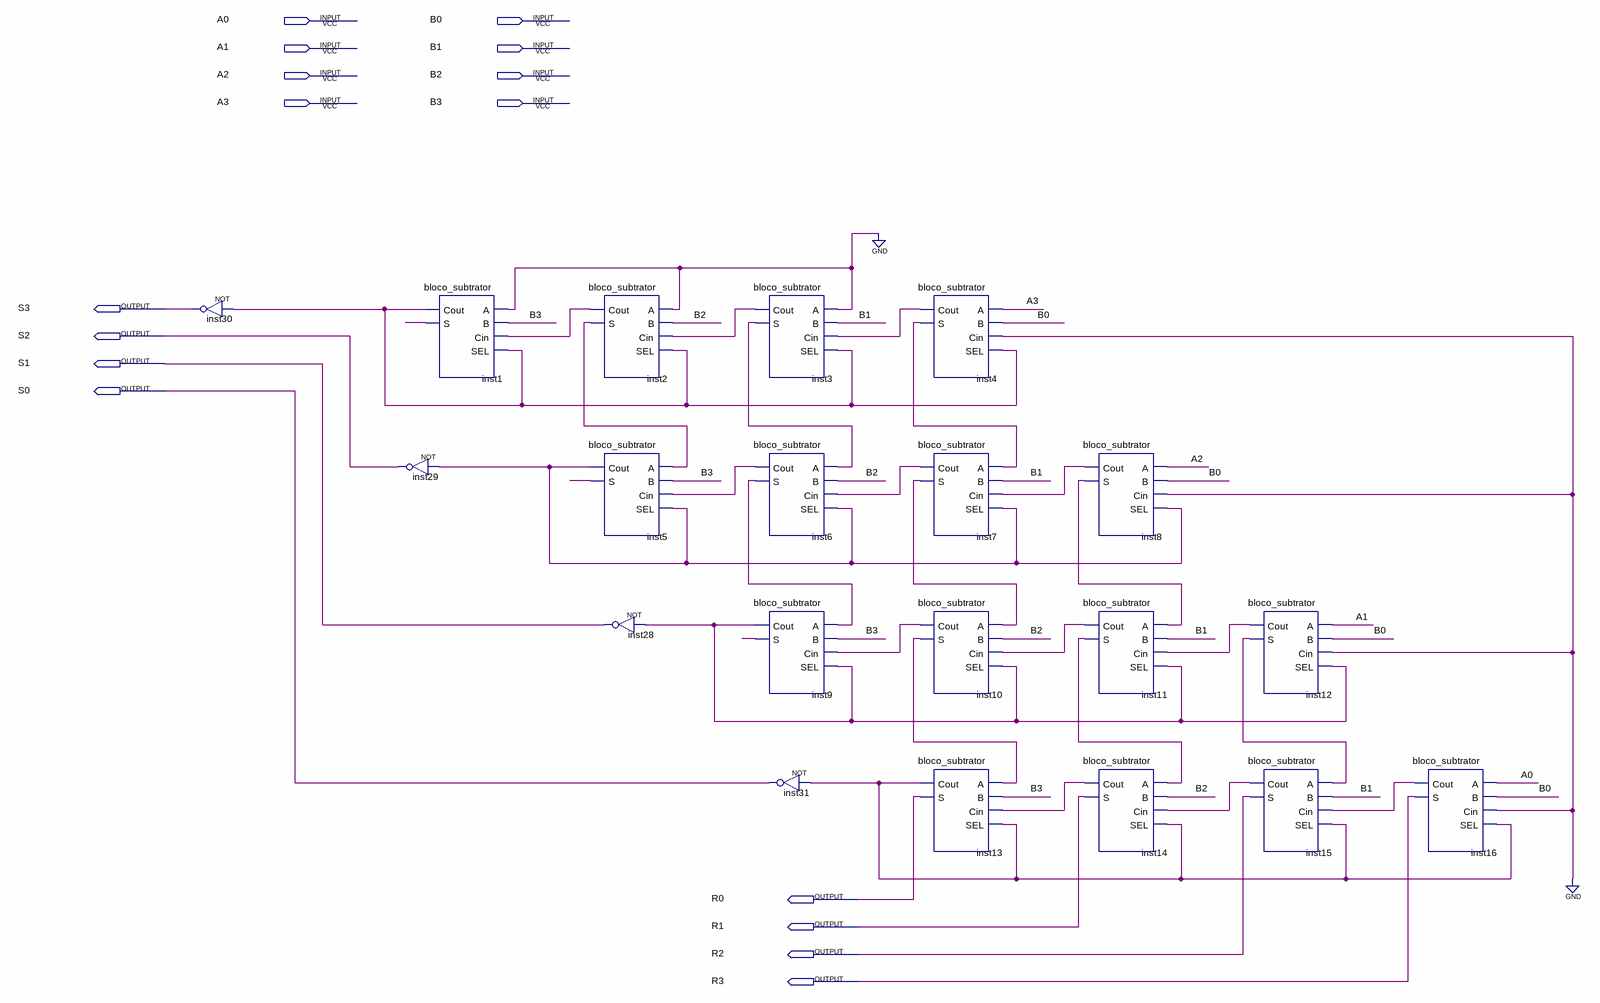
[diagram p0: schematic sheet]
// Quartus schematic divisor.bdf as structural Verilog: 20 symbols, 16 pins
module divisor (
  input  A0,
  input  B0,
  input  A1,
  input  B1,
  input  A2,
  input  B2,
  input  A3,
  input  B3,
  output S3,
  output S2,
  output S1,
  output S0,
  output R0,
  output R1,
  output R2,
  output R3
);

  wire inst1_cout, inst1_s, inst2_cout, inst2_s, inst3_cout, inst3_s, inst4_cout, inst4_s, inst5_cout,
       inst5_s, inst6_cout, inst6_s, inst7_cout, inst7_s, inst8_cout, inst8_s, inst9_cout, inst9_s,
       inst10_cout, inst10_s, inst11_cout, inst11_s, inst12_cout, inst12_s, inst13_cout, inst14_cout,
       inst15_cout, inst16_cout;

  not inst30 (S3, inst1_cout);
  not inst29 (S2, inst5_cout);
  bloco_subtrator inst1 (.A(1'b0), .B(B3), .Cin(inst2_cout), .SEL(inst1_cout), .Cout(inst1_cout), .S(inst1_s));
  bloco_subtrator inst2 (.A(1'b0), .B(B2), .Cin(inst3_cout), .SEL(inst1_cout), .Cout(inst2_cout), .S(inst2_s));
  bloco_subtrator inst5 (.A(inst2_s), .B(B3), .Cin(inst6_cout), .SEL(inst5_cout), .Cout(inst5_cout), .S(inst5_s));
  not inst28 (S1, inst9_cout);
  bloco_subtrator inst3 (.A(1'b0), .B(B1), .Cin(inst4_cout), .SEL(inst1_cout), .Cout(inst3_cout), .S(inst3_s));
  bloco_subtrator inst6 (.A(inst3_s), .B(B2), .Cin(inst7_cout), .SEL(inst5_cout), .Cout(inst6_cout), .S(inst6_s));
  bloco_subtrator inst9 (.A(inst6_s), .B(B3), .Cin(inst10_cout), .SEL(inst9_cout), .Cout(inst9_cout), .S(inst9_s));
  not inst31 (S0, inst13_cout);
  bloco_subtrator inst4 (.A(A3), .B(B0), .Cin(1'b0), .SEL(inst1_cout), .Cout(inst4_cout), .S(inst4_s));
  bloco_subtrator inst7 (.A(inst4_s), .B(B1), .Cin(inst8_cout), .SEL(inst5_cout), .Cout(inst7_cout), .S(inst7_s));
  bloco_subtrator inst10 (.A(inst7_s), .B(B2), .Cin(inst11_cout), .SEL(inst9_cout), .Cout(inst10_cout), .S(inst10_s));
  bloco_subtrator inst13 (.A(inst10_s), .B(B3), .Cin(inst14_cout), .SEL(inst13_cout), .Cout(inst13_cout), .S(R0));
  bloco_subtrator inst8 (.A(A2), .B(B0), .Cin(1'b0), .SEL(inst5_cout), .Cout(inst8_cout), .S(inst8_s));
  bloco_subtrator inst11 (.A(inst8_s), .B(B1), .Cin(inst12_cout), .SEL(inst9_cout), .Cout(inst11_cout), .S(inst11_s));
  bloco_subtrator inst14 (.A(inst11_s), .B(B2), .Cin(inst15_cout), .SEL(inst13_cout), .Cout(inst14_cout), .S(R1));
  bloco_subtrator inst12 (.A(A1), .B(B0), .Cin(1'b0), .SEL(inst9_cout), .Cout(inst12_cout), .S(inst12_s));
  bloco_subtrator inst15 (.A(inst12_s), .B(B1), .Cin(inst16_cout), .SEL(inst13_cout), .Cout(inst15_cout), .S(R2));
  bloco_subtrator inst16 (.A(A0), .B(B0), .Cin(1'b0), .SEL(inst13_cout), .Cout(inst16_cout), .S(R3));
endmodule
